# EAGLE design Colony (EAGLE 6.4)
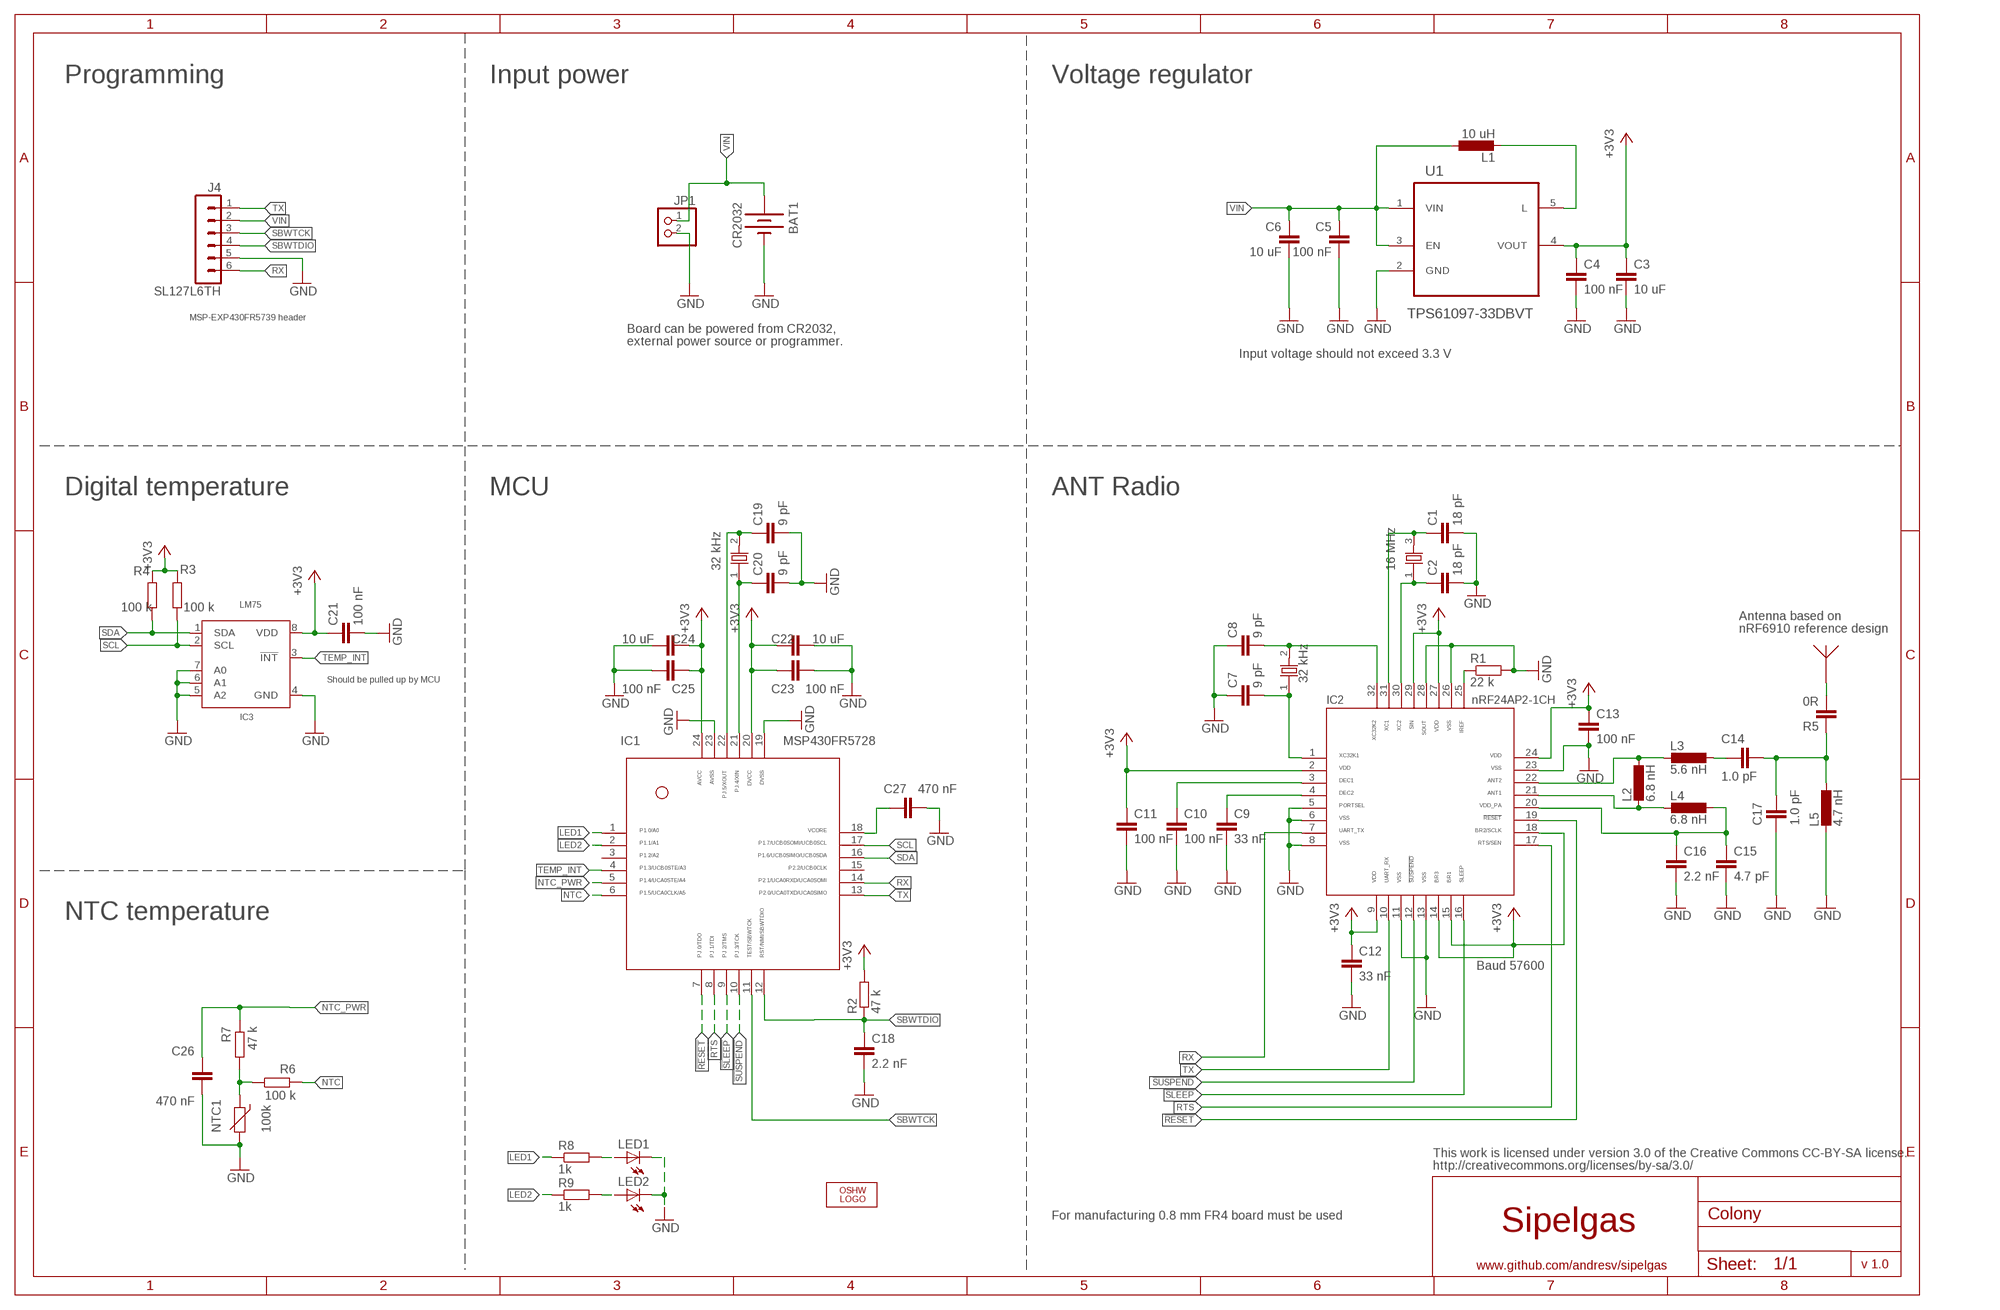
[diagram p0: schematic, sheet 1]

## Parts
BAT1  CR2032  LINX-BAT-HLD-00120SMD  [BATTCON_20MM]
C1  18 pF  C-EUC0402  [C0402]
C2  18 pF  C-EUC0402  [C0402]
C3  10 uF  C-EUC0402  [C0402]
C4  100 nF  C-EUC0402  [C0402]
C5  100 nF  C-EUC0402  [C0402]
C6  10 uF  C-EUC0402  [C0402]
C7  9 pF  C-EUC0402  [C0402]
C8  9 pF  C-EUC0402  [C0402]
C9  33 nF  C-EUC0402  [C0402]
C10  100 nF  C-EUC0402  [C0402]
C11  100 nF  C-EUC0402  [C0402]
C12  33 nF  C-EUC0402  [C0402]
C13  100 nF  C-EUC0402  [C0402]
C14  1.0 pF  C-EUC0402  [C0402]
C15  4.7 pF  C-EUC0402  [C0402]
C16  2.2 nF  C-EUC0402  [C0402]
C17  1.0 pF  C-EUC0402  [C0402]
C18  2.2 nF  C-EUC0402  [C0402]
C19  9 pF  C-EUC0402  [C0402]
C20  9 pF  C-EUC0402  [C0402]
C21  100 nF  C-EUC0402  [C0402]
C22  10 uF  C-EUC0402  [C0402]
C23  100 nF  C-EUC0402  [C0402]
C24  10 uF  C-EUC0402  [C0402]
C25  100 nF  C-EUC0402  [C0402]
C26  470 nF  C-EUC0402  [C0402]
C27  470 nF  C-EUC0402  [C0402]
IC1  MSP430FR5728  FR57XX--RF24  [QFN-24]
IC2  nRF24AP2-1CH  NRF24AP2  [QFN-32]
IC3  LM75  [MSOP8]
J4  SL127L6TH  [SL127L6_MPE]
JP1  PINHD-1X2  [1X02]
L1  10 uH  L-EUL0805  [L0805]
L2  6.8 nH  L-EUL0402  [L0402]
L3  5.6 nH  L-EUL0402  [L0402]
L4  6.8 nH  L-EUL0402  [L0402]
L5  4.7 nH  L-EUL0402  [L0402]
LED1  LEDCHIP-LED0603  [CHIP-LED0603]
LED2  LEDCHIP-LED0603  [CHIP-LED0603]
LOGO1  OSHW_LOGO_6MILX0100-NT  [OSHW_6X100_NOTEXT]
NTC1  100k  THERMISTOR-2,5  [RS-2,5]
Q1  16 MHz  CTS403  [CTS402_3.2X2.5]
Q2  32 kHz  ABS07  [ABS07]
Q3  32 kHz  ABS07  [ABS07]
R1  22 k  R-EU_R0402  [R0402]
R2  47 k  R-EU_R0402  [R0402]
R3  100 k  R-EU_R0402  [R0402]
R4  100 k  R-EU_R0402  [R0402]
R5  0R  C-EUC0201  [C0201]
R6  100 k  R-EU_R0402  [R0402]
R7  47 k  R-EU_R0402  [R0402]
R8  1k  R-EU_R0402  [R0402]
R9  1k  R-EU_R0402  [R0402]
U1  TPS61097-33DBVT  [SOT95P280X145-5N]
U$1  NRF6910-ANTENNA  [NRF6910]

## Nets
!RESET: IC1.7 IC2.19
!SLEEP: IC1.9 IC2.16
!SUSPEND: IC1.10 IC2.12
+3V3: C3.1 C4.1 C11.1 C12.1 C13.1 C21.1 C22.1 C23.1 C24.1 C25.1 IC1.20 IC1.24 IC2.2 IC2.9 IC2.14 IC2.15 IC2.18 IC2.24 IC2.27 IC2.29 IC3.8(VDD) R2.2 R3.2 R4.2 U1.4(VOUT)
ANT: C14.2 C17.1 L5.1 R5.1
GND: BAT1.2(-) C1.2 C2.2 C3.2 C4.2 C5.2 C6.2 C7.1 C8.1 C9.2 C10.2 C11.2 C12.2 C13.2 C15.2 C16.2 C17.2 C18.2 C19.2 C20.2 C21.2 C22.2 C23.2 C24.2 C25.2 C26.2 C27.2 IC1.19 IC1.23 IC2.5 IC2.6 IC2.8 IC2.11 IC2.13 IC2.23 IC2.26 IC2.28 IC3.4(GND) IC3.5(A2) IC3.6(A1) IC3.7(A0) J4.5 JP1.2 L5.2 LED1.C LED2.C NTC1.2 R1.2 U1.2(GND)
LED1: IC1.1 R8.1
LED2: IC1.2 R9.1
N$1: C2.1 IC2.30 Q1.1
N$2: C1.1 IC2.31 Q1.3
N$3: L1.2 U1.5(L)
N$4: IC2.25 R1.1
N$5: C9.1 IC2.4
N$6: C7.2 IC2.1 Q3.1
N$7: C8.2 IC2.32 Q3.2
N$8: C10.1 IC2.3
N$9: C20.1 IC1.21 Q2.1
N$10: C19.1 IC1.22 Q2.2
N$11: NTC1.1 R6.1 R7.1
N$12: C27.1 IC1.18
N$13: LED1.A R8.2
N$14: R5.2 U$1.P$1
N$15: LED2.A R9.2
N$17: IC2.22 L2.1 L3.2
N$18: IC2.21 L2.2 L4.2
N$19: C15.1 C16.1 IC2.20 L4.1
N$20: C14.1 L3.1
NTC: IC1.6 R6.2
NTC_PWR: C26.1 IC1.5 R7.2
RTS: IC1.8 IC2.17
RX: IC1.14 IC2.7 J4.6
SBWTCK: IC1.11 J4.3
SBWTDIO: C18.1 IC1.12 J4.4 R2.1
SCL: IC1.17 IC3.2(SCL) R3.1
SDA: IC1.16 IC3.1(SDA) R4.1
TEMP_INT: IC1.4 IC3.3(!INT)
TX: IC1.13 IC2.10 J4.1
VIN: BAT1.1(+) C5.1 C6.1 J4.2 JP1.1 L1.1 U1.1(VIN) U1.3(EN)
Unconnected: IC1.3 IC1.15 IC2.33(GND)

## Notes on the sheet
- Programming | Input power | Voltage regulator
- MSP-EXP430FR5739 header
- Board can be powered from CR2032,
- external power source or programmer.
- Input voltage should not exceed 3.3 V
- Digital temperature | MCU | ANT Radio
- Antenna based on
- nRF6910 reference design
- Should be pulled up by MCU
- NTC temperature
- Baud 57600
- This work is licensed under version 3.0 of the Creative Commons CC-BY-SA license.
- http://creativecommons.org/licenses/by-sa/3.0/
- For manufacturing 0.8 mm FR4 board must be used
- Sipelgas
- www.github.com/andresv/sipelgas | v 1.0

## Library data of the parts
BAT1 = battery:LINX-BAT-HLD-001: Battery Holders Linxtechnologies CR2032 battery holder: http://www.linxtechnologies.com/resources/diagrams/bat-hld-001.pdf
C1-C27 R5 = rcl:C-EU: CAPACITOR, European symbol
IC1 = TI_MSP430_v16:FR57XX--RF24
IC2 = nRF24AP2:NRF24AP2
IC3 = temp_sensor:LM75
J4 = susbfet:SL127L6TH
JP1 = pinhead:PINHD-1X2: PIN HEADER
L1-L5 = rcl:L-EU: INDUCTOR, European symbol
LED1 LED2 = led:LED: LED OSRAM: - CHIPLED LG R971, LG N971, LY N971, LG Q971, LY Q971, LO R971, LY R971 LH N974, LH R974 LS Q976, LO Q976, LY Q976 LO Q996 - Hyper CHIPLED LW Q18S LB Q993, LB Q99A, LB R99A - SideLED LS A670, LO A670, LY A670, LG A670, LP A670 LB A673, LV A673, LT A673, LW A673 LH A674 LY A675 LS A676, LA A676, LO A676, LY A676, LW A676 LS A679, LY A679, LG A679 - Hyper Micro SIDELED® LS Y876, LA Y876, LO Y876, LY Y876 LT Y87S - SmartLED LW L88C, LW L88S LB L89C, LB L89S, LG L890 LS L89K, LO L89K, LY L89K LS L896, LA L896, LO L896, LY L896 - TOPLED LS T670, LO T670, LY T670, LG T670, LP T670 LSG T670, LSP T670, LSY T670, LOP T670, LYG T670 LG T671, LOG T671, LSG T671 LB T673, LV T673, LT T673, LW T673 LH T674 LS T676, LA T676, LO T676, LY T676, LB T676, LH T676, LSB T676, LW T676 LB T67C, LV T67C, LT T67C, LS T67K, LO T67K, LY T67K, LW E67C LS E67B, LA E67B, LO E67B, LY E67B, LB E67C, LV E67C, LT E67C LW T67C LS T679, LY T679, LG T679 LS T770, LO T770, LY T770, LG T770, LP T770 LB T773, LV T773, LT T773, LW T773 LH T774 LS E675, LA E675, LY E675, LS T675 LS T776, LA T776, LO T776, LY T776, LB T776 LHGB T686 LT T68C, LB T68C - Hyper Mini TOPLED® LB M676 - Mini TOPLED Santana® LG M470 LS M47K, LO M47K, LY M47K Source: http://www.osram.convergy.de LUXEON: - LUMILED® LXK2-PW12-R00, LXK2-PW12-S00, LXK2-PW14-U00, LXK2-PW14-V00 LXK2-PM12-R00, LXK2-PM12-S00, LXK2-PM14-U00 LXK2-PE12-Q00, LXK2-PE12-R00, LXK2-PE12-S00, LXK2-PE14-T00, LXK2-PE14-U00 LXK2-PB12-K00, LXK2-PB12-L00, LXK2-PB12-M00, LXK2-PB14-N00, LXK2-PB14-P00, LXK2-PB14-Q00 LXK2-PR12-L00, LXK2-PR12-M00, LXK2-PR14-Q00, LXK2-PR14-R00 LXK2-PD12-Q00, LXK2-PD12-R00, LXK2-PD12-S00 LXK2-PH12-R00, LXK2-PH12-S00 LXK2-PL12-P00, LXK2-PL12-Q00, LXK2-PL12-R00 Source: www.luxeon.com KINGBRIGHT: KA-3528ASYC Source: www.kingbright.com
LOGO1 = OSHW:OSHW_LOGO_6MIL
NTC1 = varistor:THERMISTOR: THERMISTOR
Q1 = cts_crystals:CTS403: CRYSTAL CTS 403 http://www.ctscorp.com/components/Datasheets/008-0288-0_F.pdf Mouser: 774-403I35D16M00000
Q2 Q3 = abracon_crystals:ABS07
R1-R4 R6-R9 = rcl:R-EU_: RESISTOR, European symbol
U1 = ti_power:TPS61097-33DBVT: SYNCHRONOUS BOOST CONVERTER; MPN: TPS61097-33DBVT; OC_FARNELL: 1755714; OC_NEWARK: 14R9550; PACKAGE: SOT-23-5; SUPPLIER: Texas Instruments
U$1 = antenna:NRF6910-ANTENNA

## Board
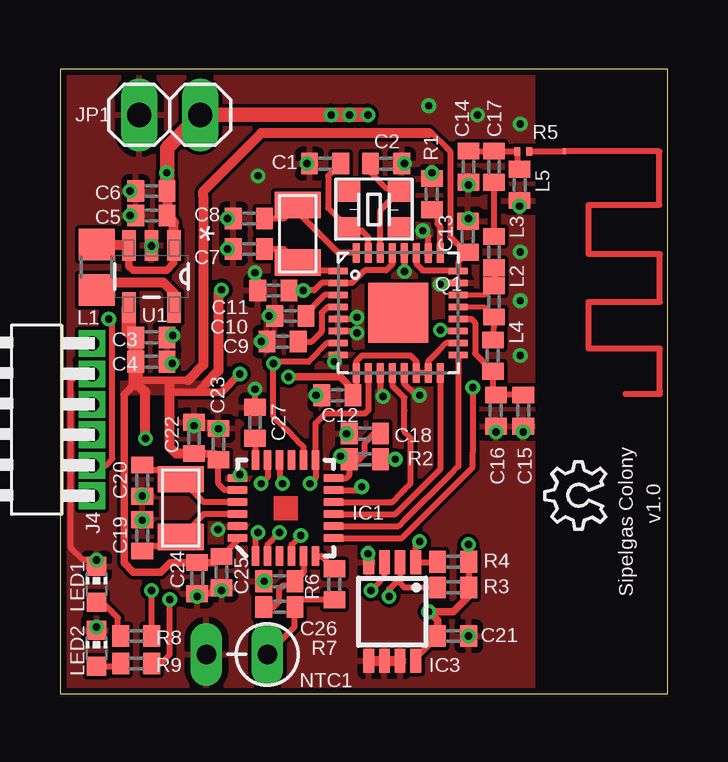
[diagram p1: board, top side]
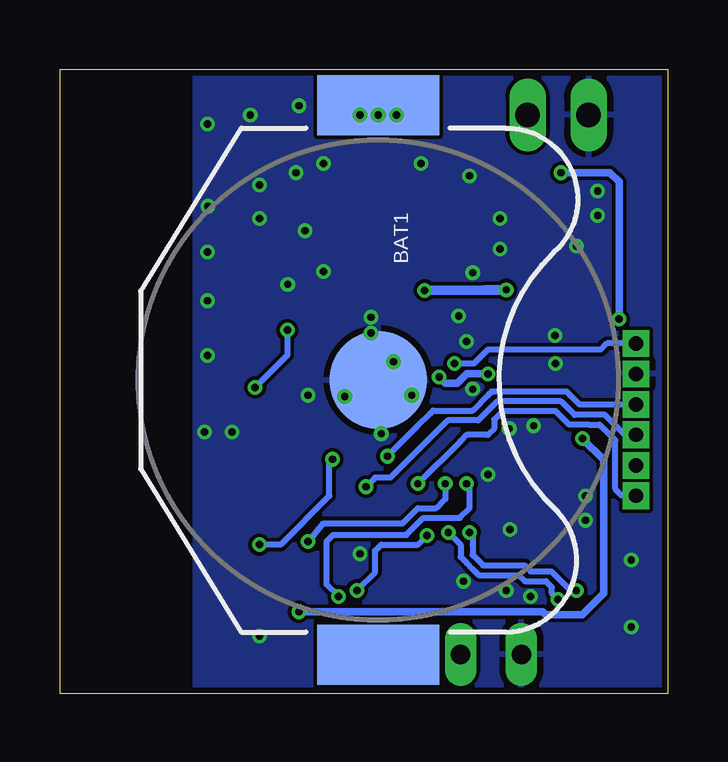
[diagram p2: board, bottom side, seen from below]

Size 25.32 x 26.02 mm. Coordinates in mm from the lower left corner, seen from the top.
Outline: 0,0 25.32,0 25.32,26.02 0,26.02 0,0
Copper layers (1*16): Top 0.035mm / dielectric 1.5mm / Bottom 0.035mm
Design rules: minimum track width 6mil, minimum drill 12mil, track to track 6mil, track to pad 6mil, pad to pad 6mil, via to via 6mil, smd to smd 0mil, copper to edge 10mil, drill to drill 10mil, minimum pad ring 10mil, minimum via ring 6mil, stop-mask expansion 2mil, vias tented up to drill 100mil, thermal gap 10mil

### Footprints (pad centres in the part's own frame; a part is rotated, then mirrored left to right if it is on the bottom)
BATTCON_20MM = smd 2.5 x 5.1: 1 -11.45,0; 3 11.45,0 | smd 4.064 x 4.064: 2 0,0
C0402 = smd 0.7 x 0.9: 1 -0.65,0; 2 0.65,0
QFN-24 = smd 0.8 x 0.3: 1 -2,1.25; 2 -2,0.75; 3 -2,0.25; 4 -2,-0.25; 5 -2,-0.75; 6 -2,-1.25; 13 2,-1.25; 14 2,-0.75; 15 2,-0.25; 16 2,0.25; 17 2,0.75; 18 2,1.25 | smd 0.3 x 0.8: 7 -1.25,-2; 8 -0.75,-2; 9 -0.25,-2; 10 0.25,-2; 11 0.75,-2; 12 1.25,-2; 19 1.25,2; 20 0.75,2; 21 0.25,2; 22 -0.25,2; 23 -0.75,2; 24 -1.25,2
QFN-32 = smd 0.285 x 0.8: 1 -1.75,-2.5; 2 -1.25,-2.5; 3 -0.75,-2.5; 4 -0.25,-2.5; 5 0.25,-2.5; 6 0.75,-2.5; 7 1.25,-2.5; 8 1.75,-2.5; 17 1.75,2.5; 18 1.25,2.5; 19 0.75,2.5; 20 0.25,2.5; 21 -0.25,2.5; 22 -0.75,2.5; 23 -1.25,2.5; 24 -1.75,2.5 | smd 0.8 x 0.285: 9 2.5,-1.75; 10 2.5,-1.25; 11 2.5,-0.75; 12 2.5,-0.25; 13 2.5,0.25; 14 2.5,0.75; 15 2.5,1.25; 16 2.5,1.75; 25 -2.5,1.75; 26 -2.5,1.25; 27 -2.5,0.75; 28 -2.5,0.25; 29 -2.5,-0.25; 30 -2.5,-0.75; 31 -2.5,-1.25; 32 -2.5,-1.75 | smd 2.5 x 2.5: 33 0,0
MSOP8 = smd 0.45 x 1: 1 -0.975,-2.05; 2 -0.325,-2.05; 3 0.325,-2.05; 4 0.975,-2.05; 5 0.975,2.05; 6 0.325,2.05; 7 -0.325,2.05; 8 -0.975,2.05
SL127L6_MPE = drill 0.6 pad 0.889 square: 1 -3.17,0.07; 2 -1.91,0.07; 3 -0.63,0.07; 4 0.63,0.07; 5 1.91,0.07; 6 3.18,0.07
1X02 = drill 1.016 long: 1 -1.27,0; 2 1.27,0
L0805 = smd 1.3 x 1.5: 1 -0.95,0; 2 0.95,0
L0402 = smd 0.7 x 0.9: 1 -0.65,0; 2 0.65,0
CHIP-LED0603 = smd 0.8 x 0.8: A 0,-0.75; C 0,0.75
RS-2,5 = drill 0.813 long: 1 -1.27,0; 2 1.27,0
CTS402_3.2X2.5 = smd 1 x 0.9: 1 -1.075,-0.775; 2 1.075,-0.775; 3 1.074,0.775; 4 -1.075,0.775
ABS07 = smd 1.1 x 1.9: 1 1.2,0; 2 -1.2,0
R0402 = smd 0.7 x 0.9: 1 -0.65,0; 2 0.65,0
C0201 = smd 0.25 x 0.35: 1 -0.25,0; 2 0.25,0
SOT95P280X145-5N = smd 1.27 x 0.559: 1 -1.295,0.94; 2 -1.295,0; 3 -1.295,-0.94; 4 1.295,-0.94; 5 1.295,0.94
NRF6910 = smd 0.127 x 0.254: P$1 0.064,-0.127

### Placement (x,y rotation side)
BAT1  12.06,13.08 270 bottom
C1  11.05,22.1 180 top
C2  13.59,22.1 0 top
C3  3.81,14.86 0 top
C4  3.81,13.84 0 top
C5  3.81,19.94 180 top
C6  3.81,20.95 180 top
C7  7.87,18.54 0 top
C8  7.87,19.81 0 top
C9  9.27,14.68 180 top
C10  9.6,15.75 180 top
C11  8.89,16.81 180 top
C12  11.56,12.45 180 top
C13  16.99,19.05 90 top
C14  18.08,21.97 90 top
C15  19.3,11.81 270 top
C16  18.16,11.81 270 top
C17  17.02,21.97 270 top
C18  12.7,10.85 180 top
C19  3.43,6.6 90 top
C20  3.43,8.89 270 top
C21  16.38,2.41 0 top
C22  5.59,10.67 90 top
C23  6.6,10.41 90 top
C24  5.71,4.83 270 top
C25  6.73,5.08 270 top
C26  9.14,4.7 180 top
C27  8.13,11.3 90 top
IC1  9.4,7.75 90 top
IC2  14.1,15.88 270 top
IC3  13.84,3.43 180 top
J4  1.4,11.43 90 top
JP1  4.57,24.13 180 top
L1  1.52,17.78 270 top
L2  18.08,16.36 270 top
L3  18.08,18.41 270 top
L4  18.03,14.1 90 top
L5  19.15,21.21 270 top
LED1  1.52,4.57 0 top
LED2  1.52,1.91 0 top
LOGO1  22.73,6.86 90 top
NTC1  7.37,1.65 180 top
Q1  13.08,20.19 180 top
Q2  5.03,7.75 90 top
Q3  9.91,19.18 270 top
R1  15.49,20.83 90 top
R2  12.7,9.78 0 top
R3  16.38,4.45 0 top
R4  16.38,5.51 0 top
R5  19.3,22.61 0 top
R6  11.43,4.57 90 top
R7  9.14,3.63 180 top
R8  3.17,2.41 180 top
R9  3.17,1.27 180 top
U1  3.81,17.4 270 top
U$1  20.95,22.73 0 top

### Tracks (layer width: path | path; a pad name or v marks a point on that pad's centre or on a via)
!RESET  (via drill 0.3 pad 0.3)
  Top 0.254: IC1.7 14.24,6.5 16.89,9.14 17.2,9.45 17.2,10.03 v17.2,12.78 | IC2.19 15.89,15.12 v15.85,15.16
  Bottom 0.254: v15.85,15.16 15.85,14.12 v17.2,12.78
!SLEEP
  Top 0.254: IC1.9 13.97,7.5 15.62,9.14 15.85,9.37 IC2.16
!SUSPEND
  Top 0.254: IC1.10 13.71,8 13.84,8 14.22,8.38 14.35,8.51 14.61,8.76 14.61,9.4 14.61,10.67 14.35,10.92 14.35,11.81 14.35,12.34 14.1,12.6 13.85,12.85 IC2.12
+3V3  (via drill 0.3 pad 0.3)
  Top 0.254: IC1.20 6.87,8.5 6.6,8.76 C23.1 | IC1.24 7.4,6.4 C25.1 | v10.13,16.82 C11.1 10.59,16.82 10.9,17.12 IC2.2 12.17,17.12 12.32,17.27 12.45,17.4 12.7,17.65 13.59,17.65 13.85,17.91 IC2.29 | C12.1 12.35,12.59 IC2.9 12.35,13.87 12.45,13.97 12.57,14.1 12.95,14.1 14.61,14.1 14.85,13.86 IC2.14 IC2.15 15.35,13.87 15.77,14.3 16.1,14.62 IC2.18 | IC2.27 14.85,17.92 15.11,17.65 16.57,17.65 IC2.24 16.62,17.62 16.62,18.03 C13.1 16.91,18.4 16.51,18.8 16.26,19.05 16.26,22.61 16.13,22.73 15.49,23.37 15.37,23.37 | IC3.8 14.82,1.5 C21.1 | 17.03,4.33 R3.2 R4.2 17.03,6.22 v17.02,6.22 | R2.2 13.35,9.76 v13.97,9.78
  Top 0.305: C22.1 6.48,10.02 C23.1 | 6.48,5.48 C25.1 6.48,5.48 | 6.48,5.48 C24.1 4.59,5.48 4.19,5.08 3.05,5.08 2.67,5.46 2.67,12.48 3.16,12.97 | C12.1 12.21,12.69 11.68,13.21 v9.53,13.21 | C21.1 15.73,3.06 v15.37,3.43 16.38,3.43 17.03,4.08 17.03,4.33 | 5.33,13.08 4.45,13.08 | 4.45,13.08 3.29,13.08 | 4.57,12.95 4.45,13.08 | 5.71,12.57 5.46,12.57 | 5.46,12.57 4.57,12.57 | v7.49,13.34 6.73,12.57 5.71,12.57 | 5.71,12.57 5.46,12.57 | 5.71,12.57 6.1,12.95
  Top 0.406: C22.1 4.84,10.02 4.57,10.29 4.57,12.57 4.57,12.95 | 15.37,23.37 8.38,23.37 5.97,20.95 5.97,20.7 5.97,14.1 5.97,13.72 5.33,13.08 | v6.73,16.84 6.6,16.71 6.6,13.46 6.1,12.95 | v3.56,10.64 3.56,12.57 3.16,12.97 3.16,12.95 3.29,13.08
  Top 0.61: U1.4 2.87,15.15 C3.1 C4.1 3.16,12.97 3.16,12.95
  Bottom 0.254: v17.02,6.22 16.13,6.22 14.1,8.26 14.1,9.65 v13.97,9.78
  Bottom 0.305: v9.53,13.21 9.27,12.95 8.76,12.95 8.38,13.34 7.62,13.34 v7.49,13.34 | v15.37,3.43 5.21,3.43 5.08,3.3 3.56,3.3 2.67,4.19 2.67,9.75 v3.56,10.64
  Bottom 0.406: v10.13,16.82 7.62,16.84 v6.73,16.84
  pour Top (no thermals): 2.51,13.06 6.22,13.06 6.22,12.45 2.51,12.45
ANT
  Top 0.254: C14.2 C17.1 R5.1 19.05,21.86 L5.1
GND  (via drill 0.3 pad 0.3)
  Top 0.254: C6.2 v2.92,20.95 | C5.2 v2.92,19.94 | U1.2 v3.81,18.67 | C3.2 v4.7,14.94 | C4.2 v4.67,13.77 | LED2.C v1.52,2.79 | v5.71,4.06 C24.2 5.73,4.19 6.22,4.19 6.46,4.43 C25.2 v6.73,4.32 | C26.2 v8.51,4.7 | C21.2 v17.02,2.41 | C18.2 v11.94,10.85 | IC3.4 12.87,5.76 v12.83,5.84 | IC2.11 13.35,12.51 v13.46,12.39 | IC2.8 11.6,14.01 v11.43,13.84 | IC2.5 12.3,15.62 v12.37,15.7 | IC2.28 14.35,17.78 v14.35,17.6 | IC2.6 12.26,15.12 v12.37,15.04 | IC2.26 15.35,19.07 v15.11,19.3 | C13.2 v17.02,19.81 | C2.2 v14.35,22.1 | R1.2 v15.49,21.72 | C1.2 v10.29,22.1 | C8.1 v6.99,19.81 | C7.1 v6.99,18.54 | C11.2 8.24,17.44 v8.13,17.55 | C10.2 v8.71,15.75 | C9.2 v8.38,14.68 | C27.2 v8.13,12.7 | C23.2 v6.6,11.05 | C22.2 v5.59,11.18 | C20.2 v3.43,8.26 | C19.2 v3.43,7.24 | IC2.13 14.35,12.93 14.83,12.45 v14.99,12.45 | IC2.23 15.89,17.12 v15.84,17.07 | C16.2 v18.16,10.92 | C15.2 v19.3,10.92 | L5.2 v19.15,20.32 | C17.2 v17.02,21.21 | C12.2 v10.67,12.45 | IC1.19 7.4,9.05 v7.49,9.14 | J4.5 0.77,13.34 0.46,13.03 0.46,6.1 0.96,5.59 v1.52,5.59 LED1.C
  Top 0.406: IC3.5 IC3.6 IC3.7
  Bottom 0.254: v12.37,15.04 12.29,14.99 | BAT1.2 v13.46,12.39 | BAT1.2 12.06,13.21 v11.43,13.84 | v10.67,12.45 11.43,12.45 BAT1.2
  other vias: 6.58,6.86 19.18,23.75 17.4,24.13 15.37,24.51 19.18,14.1 19.18,16.38 19.18,18.41 8.26,21.59
  pour Bottom: 0,26.04 19.68,26.04 19.68,0 0,0
  pour Top: 0,26.04 19.68,26.04 19.68,0 0,0
LED1  (via drill 0.3 pad 0.3)
  Top 0.254: IC1.1 8.15,6.62 v8.26,6.73 | R8.1 3.83,4.3 v3.81,4.32
  Bottom 0.254: v8.26,6.73 8.13,6.6 8.13,6.22 8.13,5.79 7.7,5.36 5.97,5.36 5.71,5.11 4.85,5.11 4.45,4.7 4.06,4.32 v3.81,4.32
LED2  (via drill 0.3 pad 0.3)
  Top 0.254: IC1.2 8.65,6.24 v9.14,6.73 | R9.1 4.19,1.27 4.57,1.65 4.57,3.81 v4.57,3.94
  Bottom 0.254: v9.14,6.73 8.64,6.22 8.64,5.71 8.38,5.46 8.13,5.21 8,5.08 7.87,4.95 6.22,4.95 5.97,4.7 5.08,4.7 4.83,4.45 4.83,4.19 v4.57,3.94
N$1
  Top 0.254: IC2.30 13.35,20.16 Q1.1 | 13.96,21.17 Q1.1 | C2.1 12.94,21.73 13.59,21.08 14.04,21.08 Q1.1
N$2
  Top 0.254: IC2.31 12.85,19.03 12.57,19.3 12.12,19.3 Q1.3 11.18,20.25 11.18,21.59 11.56,21.97 C1.1
N$3
  Top 0.406: U1.5 4.75,16.71 4.45,17.02 4.32,17.14 2.22,17.14 L1.2
N$4
  Top 0.254: IC2.25 15.85,19.39 15.85,19.46 15.75,19.56 15.75,19.92 R1.1
N$5
  Top 0.254: IC2.4 11.15,16.12 10.9,15.88 10.9,15.09 10.79,14.99 10.49,14.68 C9.1
N$6
  Top 0.254: IC2.1 10.38,17.62 Q3.1 9.34,18.54 C7.2
N$7
  Top 0.254: 10.41,20.32 9.98,20.32 Q3.2 | IC2.32 11.6,18.38 10.79,19.18 10.03,19.94 Q3.2 | C8.2 9.34,19.81 Q3.2
N$8
  Top 0.254: IC2.3 11.04,16.62 10.54,16.13 10.3,15.89 C10.1
N$9
  Top 0.254: IC1.21 5.98,8 Q2.1 4.7,9.33 3.77,9.33 C20.1
N$10
  Top 0.254: IC1.22 5.98,7.5 Q2.2 4.7,6.17 3.77,6.17 C19.1
N$11
  Top 0.254: R6.1 10.03,3.92 R7.1 9.78,3.67 9.78,2.79 NTC1.1
N$12
  Top 0.254: IC1.18 8.15,10.63 C27.1
N$13
  Top 0.254: LED1.A 1.77,3.82 2.16,3.43 2.41,3.17 2.41,2.54 2.41,2.52 R8.2
N$14
  Top 0.254: R5.2 U$1.P$1
N$15
  Top 0.254: LED2.A 2.41,1.16 R9.2
N$17
  Top 0.206: IC2.22 17.7,16.62 L2.1
  Top 0.254: L3.2 L2.1
N$18
  Top 0.206: IC2.21 17.67,16.12 L2.2
  Top 0.254: L2.2 L4.2
N$19
  Top 0.254: C15.1 C16.1 18.03,12.59 L4.1 17.3,14.18 17.3,15.47 17.14,15.62 IC2.20
N$20
  Top 0.254: L3.1 C14.1
NTC
  Top 0.254: IC1.6 10.9,5.75 R6.2
NTC_PWR
  Top 0.254: IC1.5 10.15,5.05 C26.1 | C26.1 9.7,4.72 | R7.2 8.64,3.63 8.91,3.63 9.14,3.86 9.14,4.37 9.3,4.52 9.62,4.52 C26.1 | C26.1 9.7,4.7
RTS
  Top 0.254: IC1.8 14.11,7 14.35,7.24 16.26,9.14 16.6,9.48 IC2.17
RX  (via drill 0.3 pad 0.3)
  Top 0.254: IC2.7 11.14,14.62 10.36,13.84 8.99,13.84 v8.89,13.77 8.89,11.56 9.4,11.05 9.91,10.54 10.15,10.3 IC1.14
  Bottom 0.254: J4.6 2.54,14.61 2.79,14.35 7.49,14.35 8.08,13.77 v8.89,13.77
SBWTCK  (via drill 0.3 pad 0.3)
  Top 0.254: IC1.11 12.43,8.5 v12.57,8.64
  Bottom 0.254: J4.3 1.78,10.8 2.62,11.63 3.89,11.63 4.32,12.06 4.45,12.19 7.11,12.19 7.9,11.4 9.17,11.4 9.27,11.3 10.79,9.78 10.92,9.65 11.56,9.02 12.19,9.02 v12.57,8.64
SBWTDIO  (via drill 0.3 pad 0.3)
  Top 0.254: v11.68,9.91 11.8,9.78 R2.1 | IC1.12 11.92,9 12.06,9.14 12.06,9.76 R2.1 | 13.21,10.79 C18.1 13.08,10.85 12.85,10.62 12.7,10.46 12.7,10.01 12.47,9.78 12.19,9.78 R2.1
  Bottom 0.254: v11.68,9.91 10.42,11.17 9.91,11.68 9.78,11.81 8.13,11.81 7.49,12.45 7.34,12.6 4.22,12.6 4.06,12.45 3.68,12.06 J4.4
SCL  (via drill 0.3 pad 0.3)
  Top 0.254: IC3.2 14.17,4.83 | 14.17,4.83 14.17,4.63 14.35,4.45 R3.1 | IC1.17 8.65,9.03 v8.38,8.76 | v13.72,4.06 13.72,4.37 14.17,4.83
  Bottom 0.254: 8.26,8.64 v8.38,8.76 8.26,8.64 | v13.72,4.06 14.22,4.57 14.22,6.35 13.95,6.63 10.9,6.63 10.19,7.34 8.66,7.34 8.26,7.75 8.26,8.64
SDA  (via drill 0.3 pad 0.3)
  Top 0.254: R4.1 15.71,5.48 IC3.1 14.82,6.18 v14.99,6.35 14.86,6.22 | IC1.16 9.15,8.89 v9.27,8.76
  Bottom 0.254: v14.99,6.35 14.35,7.11 11.05,7.11 10.41,7.75 9.65,7.75 9.27,8.13 v9.27,8.76
TEMP_INT  (via drill 0.3 pad 0.3)
  Top 0.254: IC1.4 9.65,6.22 v10.03,6.6 | IC3.3 13.52,4.88 13.34,4.7 v12.95,4.32
  Bottom 0.254: v12.95,4.32 12.19,5.08 12.19,5.97 11.94,6.22 10.41,6.22 v10.03,6.6
TX  (via drill 0.3 pad 0.3)
  Top 0.254: IC2.10 12.85,11.83 12.7,11.68 11.05,11.68 10.65,11.28 IC1.13 10.65,9 v10.41,8.76
  Bottom 0.254: J4.1 1.53,8.26 1.91,8.26 2.18,8.53 2.18,10.57 2.79,11.18 2.85,11.23 3.3,11.23 3.99,11.23 4.12,11.23 4.67,11.79 6.88,11.79 7.24,11.43 7.24,11.05 7.49,10.79 8.38,10.79 8.64,10.54 v10.41,8.76
VIN  (via drill 0.3 pad 0.3)
  Top 0.254: J4.2 1.9,9.52 2.18,9.8 2.18,15.47 v2.03,15.62 | v4.45,21.72 v4.46,21.72 4.46,21.97
  Top 0.305: U1.1 4.75,17.96 4.45,17.65 3.05,17.65 2.87,17.83 U1.3
  Top 0.406: C6.1 C5.1 4.75,19.65 U1.1 | U1.3 1.87,18.69 L1.1
  Top 0.61: C6.1 v4.46,21.72 4.46,21.97 4.46,22.62 4.46,22.75 4.57,22.86 JP1.1 v12.83,24.13
  Bottom 0.305: v2.03,15.62 2.03,19.68 2.03,21.34 2.41,21.72 v4.45,21.72
  Bottom 0.406: v12.83,24.13 12.43,24.13 BAT1.1
  Bottom 0.61: 12.43,24.13 v12.06,24.13 v11.3,24.13

### Text on the board
tNames: v1.0 | Sipelgas Colony